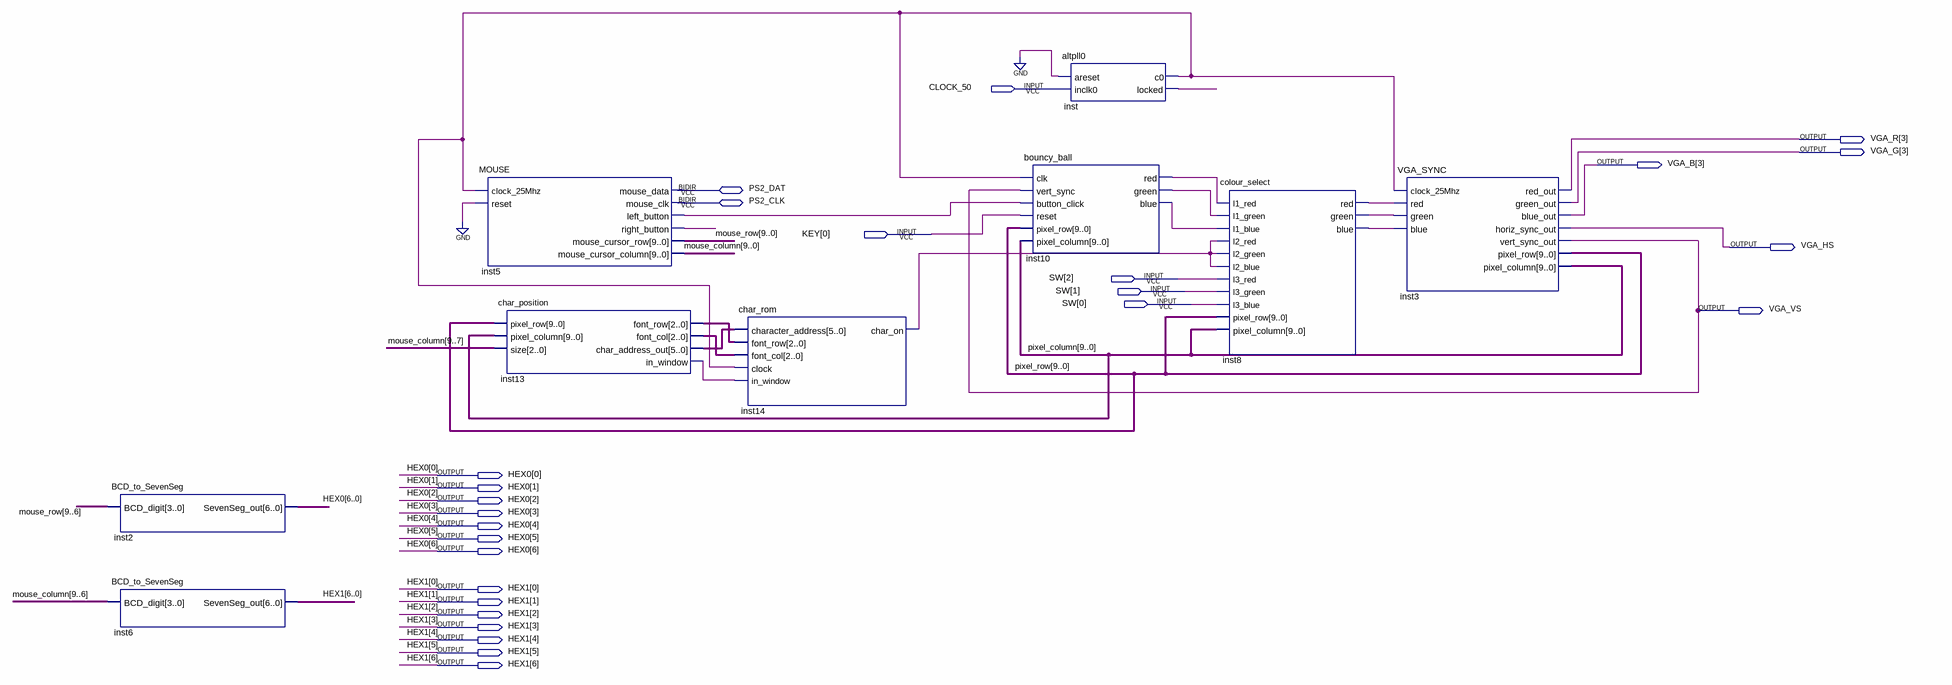
[diagram p0: schematic sheet]
// Quartus schematic mini_project.bdf as structural Verilog: 9 symbols, 26 pins
module mini_project (
  input  CLOCK_50,
  input  [0:0] KEY,
  input  [2:0] SW,
  inout  PS2_DAT,
  inout  PS2_CLK,
  output [3:3] VGA_R,
  output [3:3] VGA_G,
  output [3:3] VGA_B,
  output VGA_HS,
  output VGA_VS,
  output [6:0] HEX0,
  output [6:0] HEX1
);

  wire inst5_left_button, inst5_right_button, inst8_blue, inst8_green, inst8_red, inst10_blue, inst10_green,
       inst10_red, inst13_in_window, inst14_char_on, inst_c0, inst_locked;
  wire [2:0] inst13_font_col, inst13_font_row;
  wire [5:0] inst13_char_address_out;
  wire [9:0] mouse_column, mouse_row, pixel_column, pixel_row;

  BCD_to_SevenSeg inst2 (.BCD_digit(mouse_row[9:6]), .SevenSeg_out(HEX0));
  BCD_to_SevenSeg inst6 (.BCD_digit(mouse_column[9:6]), .SevenSeg_out(HEX1));
  MOUSE inst5 (
    .clock_25Mhz(inst_c0), .reset(1'b0), .left_button(inst5_left_button), .right_button(inst5_right_button),
    .mouse_cursor_row(mouse_row), .mouse_cursor_column(mouse_column), .mouse_data(PS2_DAT),
    .mouse_clk(PS2_CLK));
  char_position inst13 (
    .pixel_row(pixel_row), .pixel_column(pixel_column), .size(mouse_column[9:7]), .font_row(inst13_font_row),
    .font_col(inst13_font_col), .char_address_out(inst13_char_address_out), .in_window(inst13_in_window));
  char_rom inst14 (
    .character_address(inst13_char_address_out), .font_row(inst13_font_row), .font_col(inst13_font_col),
    .clock(inst_c0), .in_window(inst13_in_window), .char_on(inst14_char_on));
  bouncy_ball inst10 (
    .clk(inst_c0), .vert_sync(VGA_VS), .button_click(inst5_left_button), .reset(KEY[0]),
    .pixel_row(pixel_row), .pixel_column(pixel_column), .red(inst10_red), .green(inst10_green),
    .blue(inst10_blue));
  altpll0 inst (.areset(1'b0), .inclk0(CLOCK_50), .c0(inst_c0), .locked(inst_locked));
  colour_select inst8 (
    .l1_red(inst10_red), .l1_green(inst10_green), .l1_blue(inst10_blue), .l2_red(inst14_char_on),
    .l2_green(inst14_char_on), .l2_blue(inst14_char_on), .l3_red(SW[2]), .l3_green(SW[1]), .l3_blue(SW[0]),
    .pixel_row(pixel_row), .pixel_column(pixel_column), .red(inst8_red), .green(inst8_green),
    .blue(inst8_blue));
  VGA_SYNC inst3 (
    .clock_25Mhz(inst_c0), .red(inst8_red), .green(inst8_green), .blue(inst8_blue), .red_out(VGA_R[3]),
    .green_out(VGA_G[3]), .blue_out(VGA_B[3]), .horiz_sync_out(VGA_HS), .vert_sync_out(VGA_VS),
    .pixel_row(pixel_row), .pixel_column(pixel_column));
endmodule
